# EAGLE schematic AVR-usb-isp-connector (EAGLE 5.07)
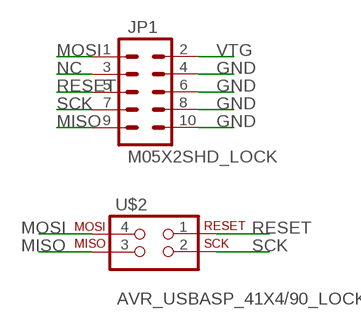
[diagram p0: schematic, sheet 1]

## Parts
JP1  M05X2SHD_LOCK  [2X5-SHROUDED_LOCK]
U$2  AVR_USBASP_41X4/90_LOCK  [1X04/90_LOCK]

## Nets
GND: JP1.4 JP1.6 JP1.8 JP1.10
MISO: JP1.9 U$2.3
MOSI: JP1.1 U$2.4
NC: JP1.3
RESET: JP1.5 U$2.1
SCK: JP1.7 U$2.2
VTG: JP1.2

## Library data of the parts
JP1 = SparkFun:M05X2: Header 5x2 Standard 10-pin dual row 0.1" header. Commonly used with AVR-ISP. Use with Spark Fun Electronics SKU: PRT-00778
U$2 = digital-toy:AVR_USBASP_4: AVR ISP 6 Pin This is the reduced ISP connector for AVR programming. Common on Arduino. This footprint will take up less PCB space and can be used with a 10-pin to 6-pin adapter such as SKU: BOB-08508